# Altium schematic sheet clock_module.SchDoc
size A4; SheetNumber: 2; SheetTotal: 5
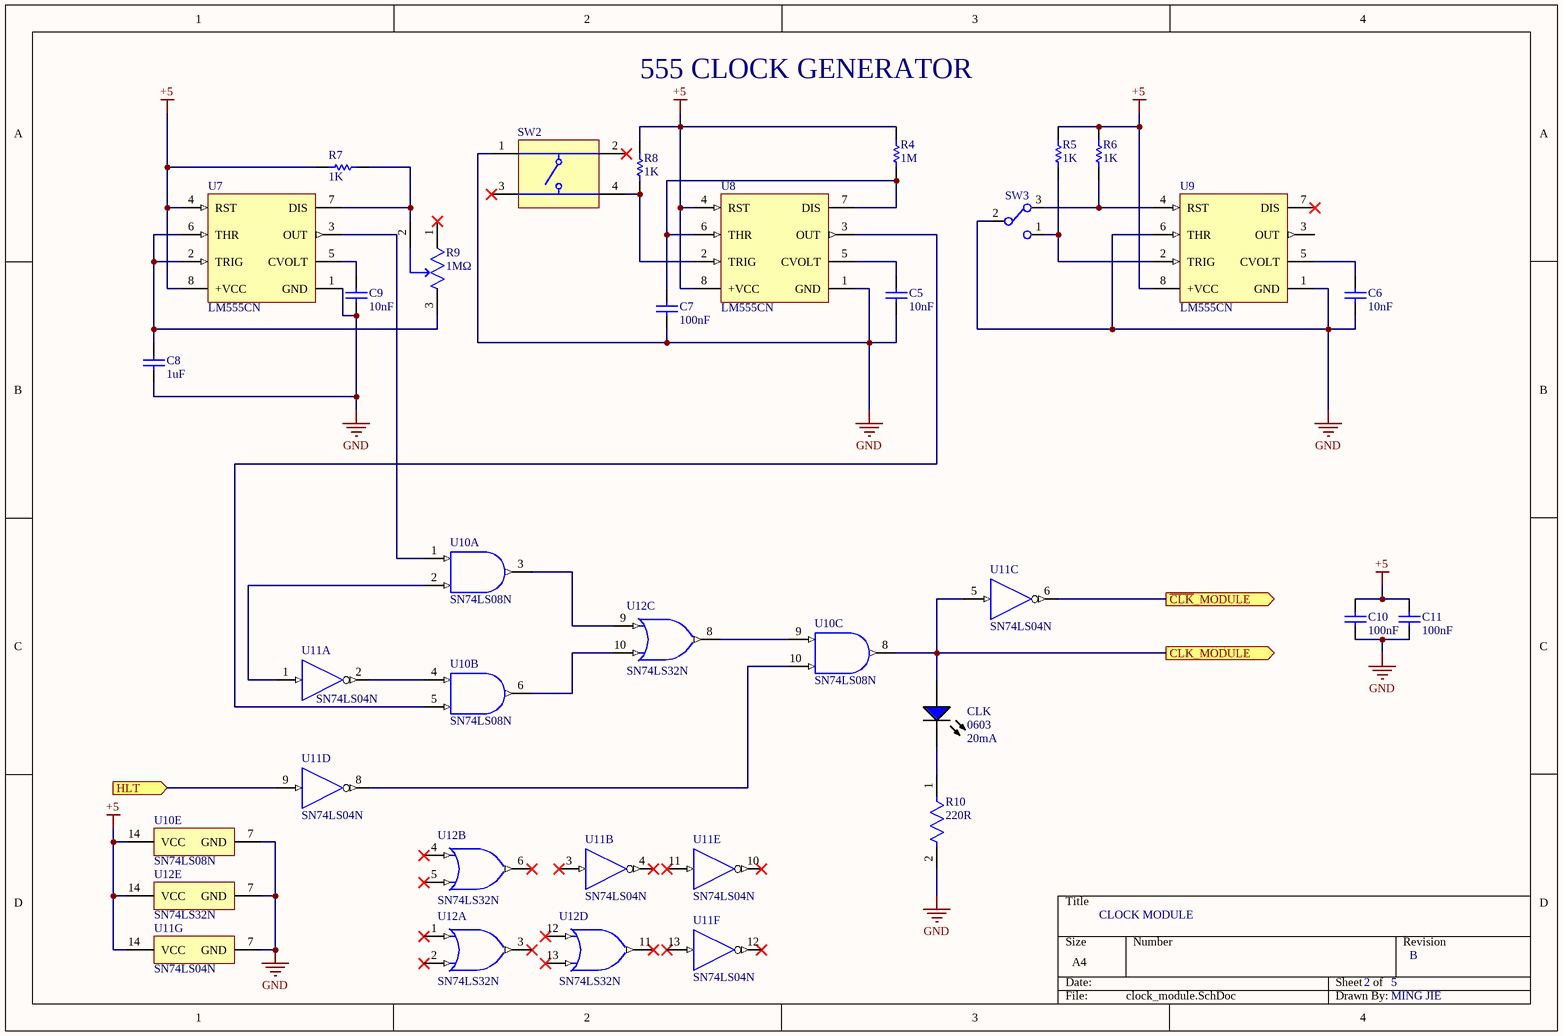
[diagram p0: clock_module.SchDoc]

## Parts
C5  Capacitance: 10nF  [CAPC2013X70X45ML10T25]  (hidden comment: GRM216R71H103KA01D)
C6  Capacitance: 10nF  [CAPC2013X70X45ML10T25]  (hidden comment: GRM216R71H103KA01D)
C7  Capacitance: 100nF  [CAPC2013X135X45ML10T25]  (hidden comment: GRM21BR71H104KA01L)
C8  Capacitance: 1uF  [CAPC2013X70X45NL10T25]  (hidden comment: GRM216R61E105KA12D)
C9  Capacitance: 10nF  [CAPC2013X70X45ML10T25]  (hidden comment: GRM216R71H103KA01D)
C10  Capacitance: 100nF  [CAPC2013X135X45ML10T25]  (hidden comment: GRM21BR71H104KA01L)
C11  Capacitance: 100nF  [CAPC2013X135X45ML10T25]  (hidden comment: GRM21BR71H104KA01L)
CLK  Package Reference: 0603  Test Current: 20mA  [EVRL-0603-2_V]  (hidden comment: 19-217/BHC-ZL1M2RY/3T)
R4  Resistance: 1M  [RESC2013X50X30NL20T20]  (hidden comment: CRCW08051M00JNEA)
R5  Resistance: 1K  [RESC2013X50X30NL20T20]  (hidden comment: CRCW08051K00FKEA)
R6  Resistance: 1K  [RESC2013X50X30NL20T20]  (hidden comment: CRCW08051K00FKEA)
R7  Resistance: 1K  [RESC2013X50X30NL20T20]  (hidden comment: CRCW08051K00FKEA)
R8  Resistance: 1K  [RESC2013X50X30NL20T20]  (hidden comment: CRCW08051K00FKEA)
R9  Resistance: 1MΩ  [FP-3296W-MFG]  (hidden comment: 3296W-1-105LF)
R10  Resistance: 220R  [FP-CRCW0805-e3-MFG]  (hidden comment: CRCW0805220RFKEA)
SW2  K2-1102SP-C4SC-04  [TECO-FSM4JSMA_V]  (value not drawn)
SW3  SS-12D02-VG4  [5_2-54mm_SPDT]  (value not drawn)
U7  LM555CN  [N08E]
U8  LM555CN  [N08E]
U9  LM555CN  [N08E]
U10  SN74LS08N  [N0014A]  (parts A,B,C,E of 5)
U11  SN74LS04N  [N0014A]  (parts A,B,C,D,E,F,G of 7)
U12  SN74LS32N  [N0014A]  (parts A,B,C,D,E of 5)

## Ports
CLK_MODULE (out), HLT (in), ~{CLK}_MODULE (out)

## Nets
+5: C10.1 C11.1 R4.1 R5.2 R6.2 R7.1 R8.2 U7.4(RST) U7.8(+VCC) U8.4(RST) U8.8(+VCC) U9.8(+VCC) U10.14(VCC) U11.14(VCC) U12.14(VCC)
GND: C5.1 C6.1 C7.2 C8.2 C9.1 C10.2 C11.2 R10.2 SW2.1 SW3.2 U7.1(GND) U8.1(GND) U9.1(GND) U9.6(THR) U10.7(GND) U11.7(GND) U12.7(GND)
~{CLK}_MODULE: U11.6(~{3Y}) ; port ~{CLK}_MODULE
CLK_MODULE: CLK.1(A) U10.8(3Y) U11.5(3A) ; port CLK_MODULE
HLT: U11.9(4A) ; port HLT
NetC5_2: C5.2 U8.5(CVOLT)
NetC6_2: C6.2 U9.5(CVOLT)
NetC7_1: C7.1 R4.2 U8.6(THR) U8.7(DIS)
NetC8_1: C8.1 R9.3(CW) U7.2(TRIG) U7.6(THR)
NetC9_2: C9.2 U7.5(CVOLT)
NetCLK_2: CLK.2(K) R10.1
NetR5_1: R5.1 SW3.1 U9.2(TRIG)
NetR6_1: R6.1 SW3.3 U9.4(RST)
NetR7_2: R7.2 R9.2(WIPER) U7.7(DIS)
NetR8_1: R8.1 SW2.4 U8.2(TRIG)
NetU7_3: U7.3(OUT) U10.1(1A)
NetU8_3: U8.3(OUT) U10.5(2B)
NetU10_2: U10.2(1B) U11.1(1A)
NetU10_3: U10.3(1Y) U12.9(3A)
NetU10_4: U10.4(2A) U11.2(~{1Y})
NetU10_6: U10.6(2Y) U12.10(3B)
NetU10_9: U10.9(3A) U12.8(3Y)
NetU10_10: U10.10(3B) U11.8(~{4Y})

Not connected (* = marked no-connect by the designer): R9 1(CCW)*; SW2 2* 3*; U9 3(OUT) 7(DIS)*; U11 3(2A)* 4(~{2Y})* 10(~{5Y})* 11(5A)* 12(~{6Y})* 13(6A)*; U12 1(1A)* 2(1B)* 3(1Y)* 4(2A)* 5(2B)* 6(2Y)* 11(4Y)* 12(4A)* 13(4B)*

## Notes on the sheet
- 555 CLOCK GENERATOR
- CLOCK MODULE
- 2
- 5
- B
- MING JIE

## Library data of the parts
C5 C6 C9 = CMP-2000-05013-1: Chip Capacitor, 10 nF, +/- 10%, 50 V, -55 to 125 degC, 0805 (2012 Metric), RoHS, Tape and Reel; Manufacturer: Murata; Voltage Rating DC: 50V; Temperature Coefficient / Code: +/-15%; Capacitance - pF: 10000pF; Case Height: 0.6mm; Dielectric: X7R; Case Length: 2mm; Case Width: 1.25mm; Type: GeneralPurposeMLCC; Brand: MurataElectronics; Tolerance: 10%; Product Category: MultilayerCeramicCapacitorsMLCC-SMD/SMT; Minimum Operating Temperature: -55C; Voltage Rating: 50V; Series: GRM; Packaging: Reel; Dimensions: 1.25mmWx2mmLx0.6mmH; Operating Temperature Range: -55Cto+125C; Package / Case: 0805(2012metric); Datasheet URL: https://datasheet.ciiva.com/29201/452521-da-01-en-vs-kondensator-0805-29201121.pdf; Maximum Operating Temperature: +125C; Factory Pack Quantity: 4000; Case Code - in: 0805; Case Code - mm: 2012; Manufacturer URL: http://www.murata.com/; Termination Style: SMD/SMT; Datasheet Version: Dec-10; RoHS: Details; Product: GeneralTypeMLCCs; Capacitance - nF: 10nF
C7 C10 C11 = CMP-2100-03644-1: Chip Capacitor, 0.1 uF, +/- 10%, 50 V, -55 to 125 degC, 0805 (2012 Metric), RoHS, Tape and Reel; Manufacturer: Murata; Voltage: 50V; Insulation Resistance: 10GR; Dielectric Material: Ceramic; Dielectric: X7R; Package Description: 2-Pin Surface Mount Device, Body 2 x 1.25 mm; Manufacturer URL: http://www.murata.com/; Case Code (Imperial): 0805; Datasheet URL: http://psearch.en.murata.com/capacitor/product/GRM21BR71H104KA01%23.pdf; Termination: SMD/SMT; Lead Free: LeadFree; Package Quantity: 1; Mount: SurfaceMount; REACH SVHC: Unknown; Thickness: 0.053inch; Height: 1.25mm; Case/Package: 0805; Voltage Rating: 50V; Width: 0.049inch; Case Code (Metric): 2012; Material: Ceramic; Min Operating Temperature: -55degC; RoHSCompliant: true; Datasheet Version: 42675.0; Voltage Rating (DC): 50V; Tolerance: 10%; Package Reference: 0805; Depth: 1.25mm; Length: 2mm; Max Operating Temperature: 125degC; Packaging: TapeandReel; Number of Pins: 2; Radiation Hardening: No
C8 = CMP-2007-00957-1: Manufacturer: Murata; Part Number: GRM216R61E105KA12D
CLK = CMP-2100-03577-1: Chip LED, Blue, 5 V, 25 mA, -40 to 85 degC, 2-Pin SMD (0603), RoHS, Tape and Reel; Manufacturer: Everlight Electronics; Number of LEDs: 1; Luminous Intensity: 28.5mcd; Lens Style: Rectangular; Forward Current: 25mA; Power Dissipation: 110W; Forward Voltage: 3V; Viewing Angle: 120degrees; Dominant Wavelength: 470nm; Max Operating Temperature: 85degC; Mount: SurfaceMount; Package Description: 2-Pin Surface Mount Device, Body 1.6 x 0.8 mm; Depth: 0.8mm; Packaging: TapeandReel; Length: 1.6mm; Radiation Hardening: No; Colour: Blue; Datasheet Version: Rev. 1.0, 03/2003; Min Operating Temperature: -40degC; Number of Elements: 1; Manufacturer URL: http://www.everlight.com/; Datasheet URL: https://datasheet.ciiva.com/26901/getdatasheetpartid-420616-26901324.pdf; Case/Package: SMD/SMT; Lead Free: LeadFree; RoHSCompliant: true; Number of Pins: 2
R4 = CMP-2001-03632-1: Manufacturer: Vishay Dale; Part Number: CRCW08051M00JNEA
R5-R8 = CMP-1013-00510-2: Manufacturer: Vishay Dale; Part Number: CRCW08051K00FKEA
R9 = CMP-2000-05583-2: TRIMMER 1M OHM 0.5W PC PIN TOP; Manufacturer: Bourns; Manufacturer Part Number: 3296W-1-504LF; Temperature Coefficient: 100ppm/°C; Value: 1MΩ; Tolerance: 10%; Voltage Rating: 300V; Standoff Height: 0.38mm; ComponentLink2Description: Datasheet; Package: 3296W; Series: Trimpot 3296-Sealed; Lead Free: Yes; Octopart: https://octopart.com/3296w-1-504lf-bourns-143884; Device Class L2: Resistors; Automotive: No; RoHS: TRUE; Temperature Range High: +125°C; Height: 12.05mm; Power Rating: 0.5W; Temperature Range Low: -55°C; ComponentLink2URL: https://www.bourns.com/docs/Product-Datasheets/3296.pdf; Device Class L1: Passive Components; Device Class L3: Variable Resistors and Potentiometers; Category: Res; Temperature: -55°C to +125°C; Digikey Description: TRIMMER 500K OHM 0.5W PC PIN TOP; Mouser Description: Trimmer; Cermet; Rest 500 Kilohms; PCB; 25 Turns; Pwr-Rtg 0.5W
R10 = CMP-2001-03682-2: RES Thick Film, 220Ω, 1%, 0.125W, 100ppm/°C, 0805; Max Power Dissipation: 125mW; Voltage Rating: 150V; Packaging: Tape and Reel; Termination: SMD/SMT; Height: 0.45mm; Package Quantity: 10; Width: 0.049inch; Min Operating Temperature: -55°C; Lead Free: Lead Free; Military Standard: Not; Mount: Surface Mount; Max Operating Temperature: 155°C; Voltage Rating (DC): 150V; Composition: Thick Film; Case/Package: 0805; Length: 2mm; Weight: 0.000194oz; Case Code (Metric): 2012; Number of Terminations: 2; Case Code (Imperial): 0805; Radiation Hardening: No; Tolerance: 1%; Features: Automotive AEC-Q200; Power Rating: 125mW; Depth: 1.25mm; Contact Plating: Tin; Temperature Coefficient: 100ppm/°C
SW2 = CMP-2000-05602-2: Swicth, SPST, 24 V, -35 to 85 degC, 4-Pin SMD, RoHS, Tape and Reel; Manufacturer: TE Connectivity; Switch Travel: 0.25mm; Mechanical Life: 100000Cycles; Contact Current Rating: 50mA; Operating Force: 1.57N; Actuator Material: Polyamide; Contact Resistance: 100mOhm; Voltage Rating: 24V; Illumination Type: Illuminated; Actuator Length: 0.055inch; Max Voltage Rating (DC): 12V; Case\/Package: SMD/SMT; Orientation: Straight; Datasheet URL: http://www.te.com/commerce/DocumentDelivery/DDEController?Action=showdoc&DocId=Customer+Drawing%7F2-1437565-7%7FV%7Fpdf%7FEnglish%7FENG_CD_2-1437565-7_V.pdf%7F4-1437565-2; Min Operating Temperature: -35degC; Packaging: LoosePiece; Termination: GullWing; Throw Configuration: SPST; Package Description: 4-Pin Surface Mount Device, Body 6 x 6 mm, Pitch 4.5 mm; Mounting Technology: SurfaceMount; Contact Plating: Silver; Datasheet Version: Rev. V, 02/2015; RoHSCompliant: true; Max Operating Temperature: 85degC; Length: 6mm; Voltage Rating (DC): 24V; Electrical Life: 100000Cycles; Current Rating: 50mA; Package Quantity: 750; Mount: SurfaceMount; Package Reference: FSM4JSMA; Manufacturer URL: http://www.te.com/; Width: 6mm; REACH SVHC: Unknown; Contact Material: CopperAlloy
SW3 = SS-12D02-VG4: SPDT, Korean Hroparts Elec SS-12D02-VG4
U7-U9 = CMP-0056-00017-2: Timer, 8-pin MDIP; Manufacturer: National Semiconductor; CompType: Analog IC; PackageTopMarking: NSUZXYTTE#*LM*555CN; PowerWise: N; PackageReference: N08E; ComponentLink1Description: LM555 Datasheet; ComponentLink3URL: http://www.national.com/packaging/folders/n08e.html; ComponentLink1URL: http://www.national.com/ds/LM/LM555.pdf; ComponentLink2URL: http://www.national.com/pf/LM/LM555.html; PackageDescription: MDIP, .365 x .250 x .130in, 8 Lead, .100in Pitch; DatasheetVersion: Jul-2006; RevisionNote: Component URLs added; Code_JEDEC: MS-001-BA; PinCount: 8; ComponentLink3Description: N08E Package Page; PackageVersion: revG, May-2006; ComponentLink2Description: LM555 Web Page; RoHS: N
U10 = CMP-0777-00259-3: Quadruple 2-Input Positive-AND Gates, N0014A, TUBE; Manufacturer: Texas Instruments; VCC(Max)(V): 5.25; ICC @ Nom Voltage(Max)(mA): 0.021; VCC(Min)(V): 4.75; tpd @ Nom Voltage(Max)(ns): 25; Rating: Catalog; Output Type: TTL; Bits(#): 4; Schmitt Trigger: No; Voltage(Nom)(V): 5; Technology Family: LS; F @ Nom Voltage(Max)(Mhz): 35; Output Drive (IOL/IOH)(Max)(mA): -0.8/16; PackageReference: N0014A; DatasheetVersion: SDLS033; Input Type: TTL; Operating Temperature Range(C): 0 to 70; Generic Part Number: SN74LS08
U11 = CMP-1615-00911-2: Hex inverters, N0014A, TUBE; Manufacturer: Texas Instruments; Output Drive (IOL/IOH)(Max)(mA): -0.4/8; Schmitt Trigger: No; F @ Nom Voltage(Max)(Mhz): 35; Voltage(Nom)(V): 5; Technology Family: LS; Input Type: TTL; Output Type: CMOS; Bits(#): 6; VCC(Max)(V): 5.25; ICC @ Nom Voltage(Max)(mA): 0.033; Rating: Catalog; VCC(Min)(V): 4.75; tpd @ Nom Voltage(Max)(ns): 22; Operating Temperature Range(C): 0 to 70; DatasheetVersion: SDLS029C; Generic Part Number: SN74LS04; Code_JEDEC: MS-001; PackageReference: N0014A
U12 = CMP-1573-00145-3: Quad 2-input positive-OR gates, N0014A, TUBE; Manufacturer: Texas Instruments; tpd @ Nom Voltage(Max)(ns): 22; Output Drive (IOL/IOH)(Max)(mA): 0.8/-16; Input Type: TTL; VCC(Min)(V): 4.75; F @ Nom Voltage(Max)(Mhz): 35; Voltage(Nom)(V): 5; ICC @ Nom Voltage(Max)(mA): 0.038; VCC(Max)(V): 5.25; Rating: Catalog; Bits(#): 4; Generic Part Number: SN74LS32; DatasheetVersion: SDLS100; Operating Temperature Range(C): 0 to 70; Output Type: TTL; Code_JEDEC: MS-001; PackageVersion: http://www.ti.com/lit/ml/mpdi002c/mpdi002c.pdf; PackageReference: N0014A